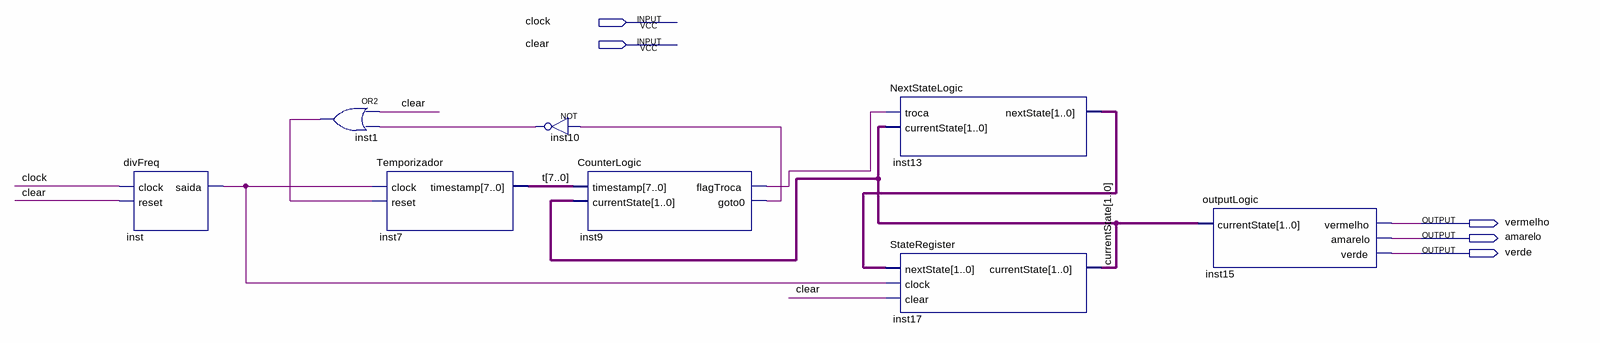
[diagram p0: schematic sheet]
// Quartus schematic ControleSemaforo.bdf as structural Verilog: 8 symbols, 5 pins
module ControleSemaforo (
  input  clock,
  input  clear,
  output vermelho,
  output amarelo,
  output verde
);

  wire inst1_out, inst9_flagtroca, inst9_goto0, inst10_out, inst_saida;
  wire [1:0] currentState, inst13_nextstate;
  wire [7:0] t;

  divFreq inst (.clock(clock), .reset(clear), .saida(inst_saida));
  or inst1 (inst1_out, clear, inst10_out);
  Temporizador inst7 (.clock(inst_saida), .reset(inst1_out), .timestamp(t));
  not inst10 (inst10_out, inst9_goto0);
  CounterLogic inst9 (.timestamp(t), .currentState(currentState), .flagTroca(inst9_flagtroca), .goto0(inst9_goto0));
  NextStateLogic inst13 (.troca(inst9_flagtroca), .currentState(currentState), .nextState(inst13_nextstate));
  StateRegister inst17 (.nextState(inst13_nextstate), .clock(inst_saida), .clear(clear), .currentState(currentState));
  outputLogic inst15 (.currentState(currentState), .vermelho(vermelho), .amarelo(amarelo), .verde(verde));
endmodule
